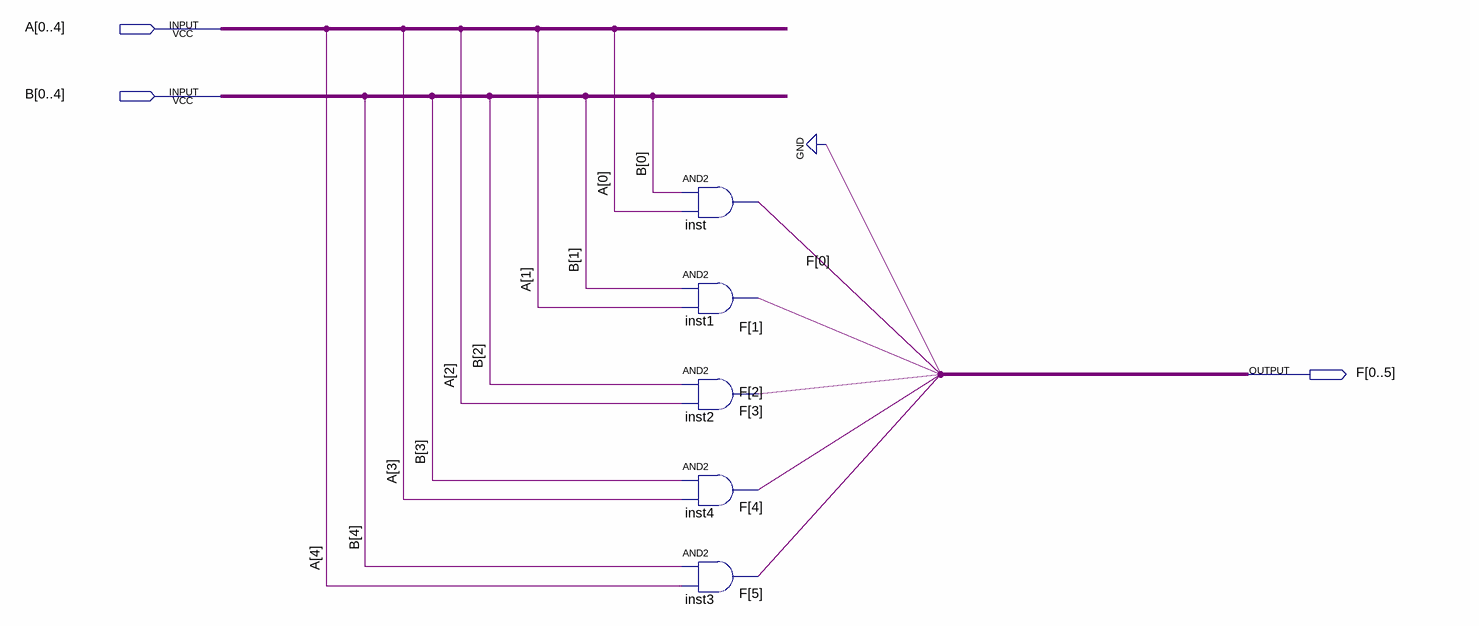
[diagram p0: schematic sheet]
// Quartus schematic ANDbitabit.bdf as structural Verilog: 5 symbols, 3 pins
module ANDbitabit (
  input  [0:4] A,
  input  [0:4] B,
  output [0:5] F
);

  and inst (F[1], B[0], A[0]);
  and inst1 (F[2], B[1], A[1]);
  and inst2 (F[3], B[2], A[2]);
  and inst4 (F[4], B[3], A[3]);
  and inst3 (F[5], B[4], A[4]);

  assign F[0] = 1'b0;
endmodule
